# Altium schematic sheet Button-connections.SchDoc
size A4; SheetNumber: 5; SheetTotal: 6
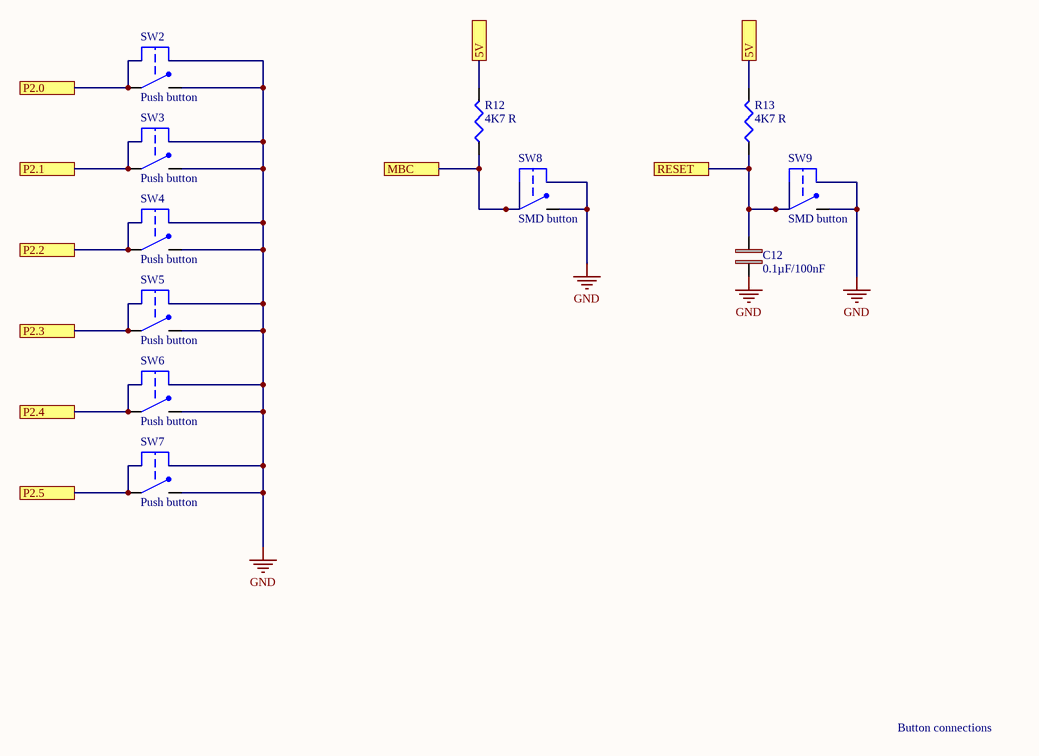
[diagram p0: Button-connections.SchDoc]

## Parts
C12  0.1µF/100nF  [MC0603B104K250CT]
R12  4K7 R  [PCF0603]
R13  4K7 R  [PCF0603]
SW2  Push button  [Tactile button]
SW3  Push button  [Tactile button]
SW4  Push button  [Tactile button]
SW5  Push button  [Tactile button]
SW6  Push button  [Tactile button]
SW7  Push button  [Tactile button]
SW8  SMD button  [TACTILE BUTTON - duplicate]
SW9  SMD button  [TACTILE BUTTON - duplicate]

## Ports
5V, MBC, P2.0, P2.1, P2.2, P2.3, P2.4, P2.5, RESET

## Nets
GND: C12.2 SW2.3 SW2.4 SW3.3 SW3.4 SW4.3 SW4.4 SW5.3 SW5.4 SW6.3 SW6.4 SW7.3 SW7.4 SW8.3 SW8.4 SW9.3 SW9.4
5V: R12.2 R13.2 ; port 5V
MBC: R12.1 SW8.1 SW8.2 ; port MBC
P2.0: SW2.1 SW2.2 ; port P2.0
P2.1: SW3.1 SW3.2 ; port P2.1
P2.2: SW4.1 SW4.2 ; port P2.2
P2.3: SW5.1 SW5.2 ; port P2.3
P2.4: SW6.1 SW6.2 ; port P2.4
P2.5: SW7.1 SW7.2 ; port P2.5
RESET: C12.1 R13.1 SW9.1 SW9.2 ; port RESET

## Notes on the sheet
- Button connections

## Library data of the parts
C12 = MC0603B104K250CT: Cap Ceramic 0.1uF 25V X7R 10% Pad SMD 0603 125C T/R; Manufacturer: Multicomp; Capacitance: 100nF; Supplier 1: Newark; Manufacturer Part Number: MC0603B104K250CT; RoHS: Yes; Category: Ceramic Capacitors; Stock 1: 124000; Pricing 1: 1=0,00300, 4000=0,00300, 8000=0,00300, 20000=0,00300 (USD); Case/Package: 0603; Number of Pins: 2; Case Code (Metric): 1608; Case Code (Imperial): 0603; Min Operating Temperature: -55°C; Max Operating Temperature: 125°C; Tolerance: 10%; Packaging: Cut Tape; Voltage Rating: 25V; Dielectric: X7R; Voltage Rating (DC): 25V; Series: MLCC; Width: 0.8mm; REACH SVHC: Unknown; RoHS Compliant: Yes; ComponentLink1URL: https://datasheet.ciiva.com/22686/1901289-22686277.pdf?src-supplier=Element14; ComponentLink1Description: https://datasheet.ciiva.com/22686/1901289-22686277.pdf?src-supplier=Element14; ComponentLink2URL: https://datasheet.ciiva.com/22648/1901289-22648410.pdf?src-supplier=Element14; ComponentLink2Description: https://datasheet.ciiva.com/22648/1901289-22648410.pdf?src-supplier=Element14; Supplier Part Number 1: 94W8728
R12 R13 = PCF0603P-R-4K7-BT1: Surface Mount Metal Film Resistor, Pcf Series, 4.7 Kohm, 63 Mw, - 0.1%, 75 V Rohs Compliant: Yes; Manufacturer: TT Welwyn; Power Rating: 63mW; Voltage Rating: 75V; Resistance: 4.7kR; Temperature Coefficient: 25ppm/°C; Case/Category: 0603; Supplier 1: Newark; Manufacturer Part Number: PCF0603P-R-4K7-BT1; RoHS: Yes; Category: Chip SMD Resistors; Stock 1: 1027; Pricing 1: 10=0,17900 (USD); Case Code (Imperial): 0603; Case Code (Metric): 1608; Tolerance: 0.1%; Packaging: Cut Tape; Resistor Type: Thin Film; Voltage Rating (DC): 75V; REACH SVHC: No SVHC; ComponentLink1URL: https://datasheet.ciiva.com/7860/3754-7860191.pdf?src-supplier=Element14; ComponentLink1Description: https://datasheet.ciiva.com/7860/3754-7860191.pdf?src-supplier=Element14; ComponentLink2URL: https://datasheet.ciiva.com/6093/3754-6093381.pdf?src-supplier=Farnell; ComponentLink2Description: https://datasheet.ciiva.com/6093/3754-6093381.pdf?src-supplier=Farnell; Supplier Part Number 1: 61M8292
SW2-SW7 = EVQ-PAG05R: Switch Tactile N.O. SPST Round Button PC Pins 0.02A 15VDC 2.6N Thru-Hole Bulk; Manufacturer: Panasonic; Mechanical Life: 50000Cycles; Actuator Color: Red; Max Voltage Rating (DC): 15V; Illumination Type: Non-Illuminated; Switch Function: Off-Mom; Actuator Type: Standard; Current Rating: 20mA; Contact Resistance: 50mR; Switch Travel: 0.25mm; Actuator Length: 1.6mm; Supplier 1: RSComponents; Manufacturer Part Number: EVQ-PAG05R; RoHS: Yes; Category: Tactile Switches; Stock 1: 1; Pricing 1: 50=0,24100, 500=0,18100 (USD); Mount: Through Hole; Contact Plating: Silver; Min Operating Temperature: -20°C; Max Operating Temperature: 70°C; Throw Configuration: SPST; Packaging: Bulk; Operating Force: 2.6N; Package Quantity: 500; Termination: PC Pin; Voltage Rating (DC): 15V; Max Current Rating: 20mA; Contact Current Rating: 20mA; Electrical Life: 50000Cycles; Orientation: Straight; Series: EVQPA; Length: 6mm; Width: 6mm; Height: 5mm; Depth: 6.5mm; Size: 6mm; Radiation Hardening: No; Lead Free: Lead Free; REACH SVHC: No SVHC; RoHS Compliant: Yes; ComponentLink1URL: https://datasheet.ciiva.com/1634/1520560-1634709.pdf?src-supplier=Farnell; ComponentLink1Description: https://datasheet.ciiva.com/1634/1520560-1634709.pdf?src-supplier=Farnell; ComponentLink2URL: https://datasheet.ciiva.com/25603/0900766b810ad3e5-25603994.pdf?src-supplier=RSComponents; ComponentLink2Description: https://datasheet.ciiva.com/25603/0900766b810ad3e5-25603994.pdf?src-supplier=RSComponents; ComponentLink3URL: https://datasheet.ciiva.com/1532/1520560-1532790.pdf?src-supplier=Element14; ComponentLink3Description: https://datasheet.ciiva.com/1532/1520560-1532790.pdf?src-supplier=Element14; ComponentLink4URL: https://datasheet.ciiva.com/24086/atk0000ce10-33274-24086442.pdf?src-supplier=Mouser; ComponentLink4Description: https://datasheet.ciiva.com/24086/atk0000ce10-33274-24086442.pdf?src-supplier=Mouser; ComponentLink5URL: https://datasheet.ciiva.com/2901/atk0000ce10-2901437.pdf?src-supplier=Digi-Key; ComponentLink5Description: https://datasheet.ciiva.com/2901/atk0000ce10-2901437.pdf?src-supplier=Digi-Key; ComponentLink6URL: https://datasheet.ciiva.com/30192/36atk0000ce10-30192373.pdf?src-supplier=Onlinecomponents.com; ComponentLink6Description: https://datasheet.ciiva.com/30192/36atk0000ce10-30192373.pdf?src-supplier=Onlinecomponents.com; ComponentLink7URL: https://datasheet.ciiva.com/8166/atk0000ce10-8166366.pdf?src-supplier=Avnet; ComponentLink7Description: https://datasheet.ciiva.com/8166/atk0000ce10-8166366.pdf?src-supplier=Avnet; ComponentLink8URL: https://datasheet.ciiva.com/16976/70270700-16976175.pdf?src-supplier=Allied+Electronics; ComponentLink8Description: https://datasheet.ciiva.com/16976/70270700-16976175.pdf?src-supplier=Allied+Electronics; Supplier Part Number 1: 7561543P
SW8 SW9 = EVQ-PLMA15: Switch Tactile N.O. SPST Round Button J-Bend 0.02A 15VDC 2.6N SMD Embossed Tape; Manufacturer: Panasonic; Mechanical Life: 200000Cycles; Max Voltage Rating (DC): 15V; Current Rating: 20mA; Contact Resistance: 50mR; Illumination Type: Non-Illuminated,Illuminated; Switch Travel: 0.25mm; Switch Function: Off-Mom; Actuator Type: Standard; Actuator Length: 0.3mm; Supplier 1: Newark; Manufacturer Part Number: EVQ-PLMA15; RoHS: Yes; Category: Tactile Switches; Stock 1: 5000; Pricing 1: 1=0,18600, 5000=0,18600, 10000=0,18000, 25000=0,17700, 50000=0,17500 (USD); Mount: Surface Mount; Contact Plating: Gold,Silver; Min Operating Temperature: -20°C; Max Operating Temperature: 70°C; Throw Configuration: SPST; Operating Force: 2.6N; Termination: J-Bend; Voltage Rating (DC): 15V; Packaging: Tape and Reel; Package Quantity: 1; Max Current Rating: 20mA; Electrical Life: 200000Cycles; Orientation: Straight; Contact Current Rating: 20mA; Voltage Rating: 15V; Insulation Resistance: 50MR; Length: 4.9mm; Width: 4.9mm; Height: 1.5mm; Depth: 4.9mm; Radiation Hardening: No; REACH SVHC: No SVHC; Lead Free: Lead Free; ComponentLink1URL: https://datasheet.ciiva.com/8164/atv0000ce2-8164994.pdf?src-supplier=Avnet; ComponentLink1Description: https://datasheet.ciiva.com/8164/atv0000ce2-8164994.pdf?src-supplier=Avnet; ComponentLink2URL: https://datasheet.ciiva.com/16205/atk0000ce3-16205767.pdf?src-supplier=Future+Electronics; ComponentLink2Description: https://datasheet.ciiva.com/16205/atk0000ce3-16205767.pdf?src-supplier=Future+Electronics; ComponentLink3URL: https://datasheet.ciiva.com/17065/70270715-17065721.pdf?src-supplier=Allied+Electronics; ComponentLink3Description: https://datasheet.ciiva.com/17065/70270715-17065721.pdf?src-supplier=Allied+Electronics; ComponentLink4URL: https://datasheet.ciiva.com/2899/atk0000ce3-2899834.pdf?src-supplier=Digi-Key; ComponentLink4Description: https://datasheet.ciiva.com/2899/atk0000ce3-2899834.pdf?src-supplier=Digi-Key; ComponentLink5URL: https://datasheet.ciiva.com/2899/atk0000ce3-2899835.pdf?src-supplier=Digi-Key; ComponentLink5Description: https://datasheet.ciiva.com/2899/atk0000ce3-2899835.pdf?src-supplier=Digi-Key; ComponentLink6URL: https://datasheet.ciiva.com/2899/atk0000ce3-2899836.pdf?src-supplier=Digi-Key; ComponentLink6Description: https://datasheet.ciiva.com/2899/atk0000ce3-2899836.pdf?src-supplier=Digi-Key; ComponentLink7URL: https://datasheet.ciiva.com/26827/getdatasheetpartid-51835-26827884.pdf?src-supplier=Verical; ComponentLink7Description: https://datasheet.ciiva.com/26827/getdatasheetpartid-51835-26827884.pdf?src-supplier=Verical; Supplier Part Number 1: 27AC5577